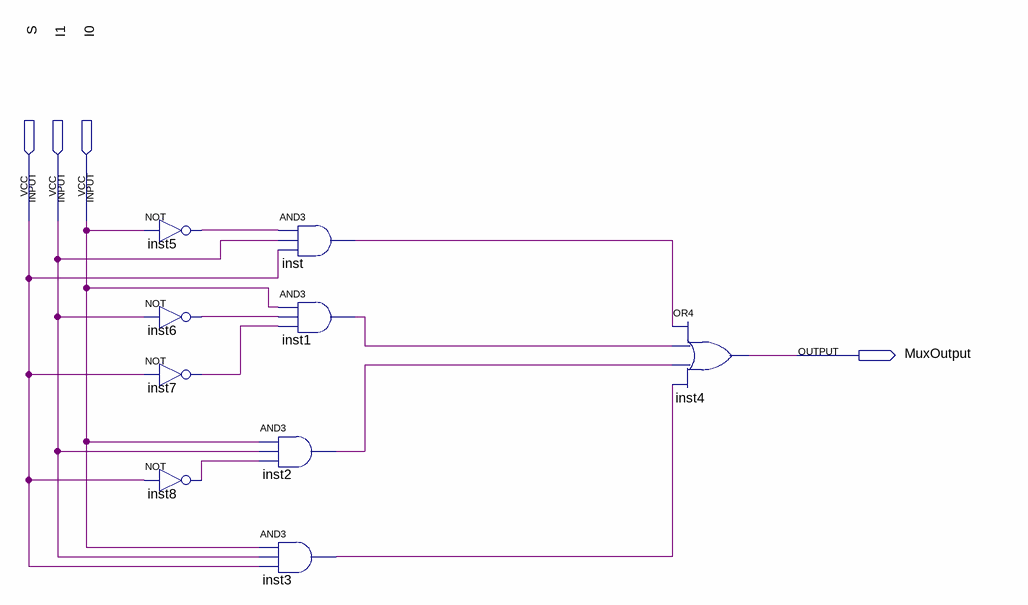
[diagram p0: schematic sheet]
// Quartus schematic Multiplex.bdf as structural Verilog: 9 symbols, 4 pins
module Multiplex (
  input  S,
  input  I1,
  input  I0,
  output MuxOutput
);

  wire inst1_out, inst2_out, inst3_out, inst5_out, inst6_out, inst7_out, inst8_out, inst_out;

  not inst5 (inst5_out, I0);
  not inst6 (inst6_out, I1);
  not inst7 (inst7_out, S);
  not inst8 (inst8_out, S);
  and inst (inst_out, inst5_out, I1, S);
  and inst1 (inst1_out, I0, inst6_out, inst7_out);
  and inst2 (inst2_out, I0, I1, inst8_out);
  and inst3 (inst3_out, I0, I1, S);
  or inst4 (MuxOutput, inst_out, inst1_out, inst2_out, inst3_out);
endmodule
